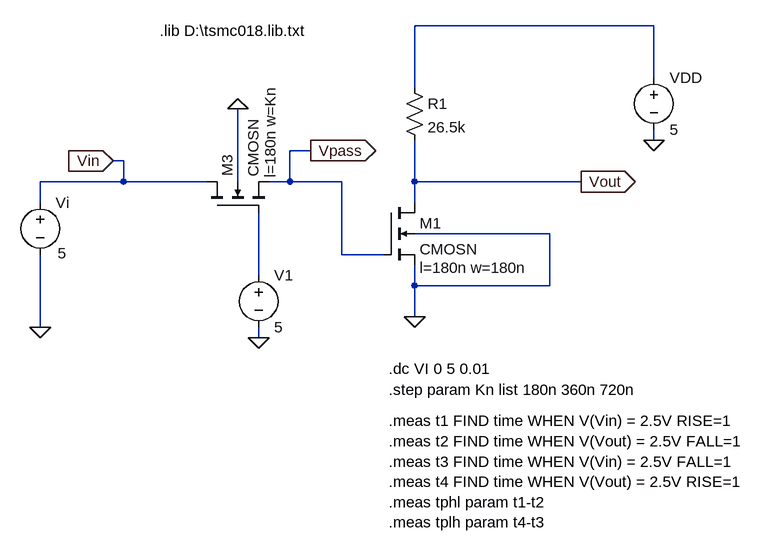
[diagram p0: schematic Eproject.asc]
Eproject.asc, the LTspice schematic file:
Version 4
SHEET 1 4604 1200
WIRE 976 128 608 128
WIRE 976 208 976 128
WIRE 608 224 608 128
WIRE 976 304 976 288
WIRE 448 320 416 320
WIRE 160 336 144 336
WIRE 160 368 160 336
WIRE 160 368 32 368
WIRE 288 368 160 368
WIRE 336 368 336 256
WIRE 416 368 416 320
WIRE 416 368 384 368
WIRE 496 368 416 368
WIRE 608 368 608 304
WIRE 864 368 608 368
WIRE 32 400 32 368
WIRE 608 400 608 368
WIRE 816 448 608 448
WIRE 496 480 496 368
WIRE 560 480 496 480
WIRE 368 512 368 416
WIRE 608 528 608 496
WIRE 816 528 816 448
WIRE 816 528 608 528
WIRE 608 576 608 528
WIRE 32 592 32 480
WIRE 368 608 368 592
FLAG 608 576 0
FLAG 976 304 0
FLAG 864 368 Vout
IOPIN 864 368 Out
FLAG 144 336 Vin
IOPIN 144 336 In
FLAG 32 592 0
FLAG 336 256 0
FLAG 368 608 0
FLAG 448 320 Vpass
IOPIN 448 320 Out
SYMBOL nmos4 560 400 R0
WINDOW 123 56 100 Left 2
SYMATTR Value2 l=180n w=180n
SYMATTR InstName M1
SYMATTR Value CMOSN
SYMBOL voltage 976 192 R0
WINDOW 123 0 0 Left 0
WINDOW 39 0 0 Left 0
SYMATTR InstName VDD
SYMATTR Value 5
SYMBOL voltage 32 384 R0
WINDOW 3 27 94 Left 2
WINDOW 123 0 0 Left 0
WINDOW 39 0 0 Left 0
SYMATTR Value 5
SYMATTR InstName Vi
SYMBOL res 592 208 R0
SYMATTR InstName R1
SYMATTR Value 26.5k
SYMBOL nmos4 288 416 R270
WINDOW 123 54 98 Left 2
SYMATTR InstName M3
SYMATTR Value CMOSN
SYMATTR Value2 l=180n w=Kn
SYMBOL voltage 368 496 R0
WINDOW 123 0 0 Left 0
WINDOW 39 0 0 Left 0
SYMATTR InstName V1
SYMATTR Value 5
TEXT 216 136 Left 2 !.lib D:\\tsmc018.lib.txt
TEXT 568 736 Left 2 !.meas t1 FIND time WHEN V(Vin) = 2.5V RISE=1\n.meas t2 FIND time WHEN V(Vout) = 2.5V FALL=1\n.meas t3 FIND time WHEN V(Vin) = 2.5V FALL=1\n.meas t4 FIND time WHEN V(Vout) = 2.5V RISE=1\n.meas tphl param t1-t2\n.meas tplh param t4-t3
TEXT 568 688 Left 2 !.step param Kn list 180n 360n 720n
TEXT 568 656 Left 2 !.dc VI 0 5 0.01

The netlist it stands for:
* Eproject.asc
M1 Vout Vpass 0 0 CMOSN l=180n w=180n
VDD N001 0 5
Vi Vin 0 5
R1 N001 Vout 26.5k
M3 Vin N002 Vpass 0 CMOSN l=180n w=Kn
V1 N002 0 5
.model NMOS NMOS
.model PMOS PMOS
.lib standard.mos
.lib D:\tsmc018.lib.txt
.meas t1 FIND time WHEN V(Vin) = 2.5V RISE=1
.meas t2 FIND time WHEN V(Vout) = 2.5V FALL=1
.meas t3 FIND time WHEN V(Vin) = 2.5V FALL=1
.meas t4 FIND time WHEN V(Vout) = 2.5V RISE=1
.meas tphl param t1-t2
.meas tplh param t4-t3
.step param Kn list 180n 360n 720n
.dc VI 0 5 0.01
.backanno
.end